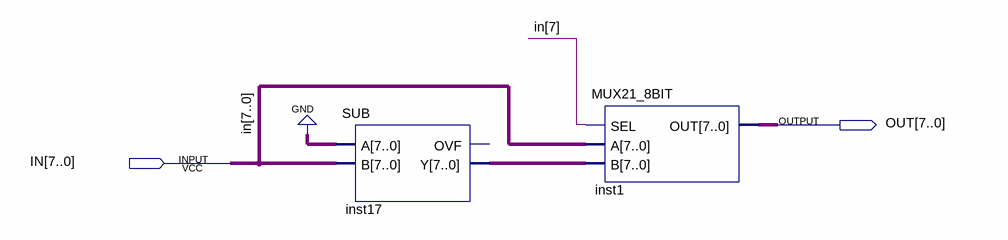
[diagram p0: schematic sheet]
// Quartus schematic ABS.bdf as structural Verilog: 2 symbols, 2 pins
module ABS (
  input  [7:0] IN,
  output [7:0] OUT
);

  wire [7:0] inst17_y;

  SUB inst17 (.A({8{1'b0}}), .B(IN), .Y(inst17_y));  // open: OVF
  MUX21_8BIT inst1 (.SEL(IN[7]), .A(IN), .B(inst17_y), .OUT(OUT));
endmodule
